# EAGLE design LePacific (EAGLE 7.7.0)
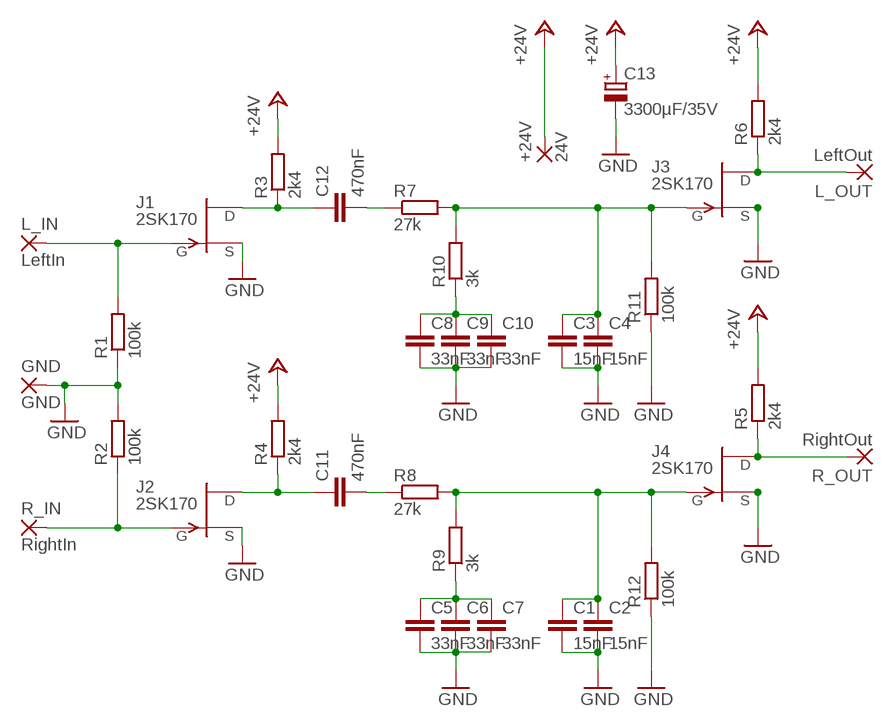
[diagram p0: schematic, sheet 1]

## Parts
+24V  24V  2,54/0,8  [2,54/0,8]
C1  15nF  C-EU150-054X183  [C150-054X183]
C2  15nF  C-EU150-054X183  [C150-054X183]
C3  15nF  C-EU150-054X183  [C150-054X183]
C4  15nF  C-EU150-054X183  [C150-054X183]
C5  33nF  C-EU225-062X268  [C225-062X268]
C6  33nF  C-EU225-062X268  [C225-062X268]
C7  33nF  C-EU225-062X268  [C225-062X268]
C8  33nF  C-EU225-062X268  [C225-062X268]
C9  33nF  C-EU225-062X268  [C225-062X268]
C10  33nF  C-EU225-062X268  [C225-062X268]
C11  470nF  C-EU225-108X268  [C225-108X268]
C12  470nF  C-EU225-108X268  [C225-108X268]
C13  3300µF/35V  CPOL-EUE7.5-16  [E7,5-16]
GND  GND  2,54/0,8  [2,54/0,8]
J1  2SK170  [TO-92]
J2  2SK170  [TO-92]
J3  2SK170  [TO-92]
J4  2SK170  [TO-92]
L_IN  LeftIn  2,54/0,8  [2,54/0,8]
L_OUT  LeftOut  2,54/0,8  [2,54/0,8]
R1  100k  R-EU_0207/10  [0207/10]
R2  100k  R-EU_0207/10  [0207/10]
R3  2k4  R-EU_0207/10  [0207/10]
R4  2k4  R-EU_0207/10  [0207/10]
R5  2k4  R-EU_0207/10  [0207/10]
R6  2k4  R-EU_0207/10  [0207/10]
R7  27k  R-EU_0207/10  [0207/10]
R8  27k  R-EU_0207/10  [0207/10]
R9  3k  R-EU_0207/10  [0207/10]
R10  3k  R-EU_0207/10  [0207/10]
R11  100k  R-EU_0207/10  [0207/10]
R12  100k  R-EU_0207/10  [0207/10]
R_IN  RightIn  2,54/0,8  [2,54/0,8]
R_OUT  RightOut  2,54/0,8  [2,54/0,8]

## Nets
+24V: +24V.1(P) C13.+ R3.2 R4.2 R5.2 R6.2
GND: C1.2 C2.2 C3.2 C4.2 C5.2 C6.2 C7.2 C8.2 C9.2 C10.2 C13.- GND.1(P) J1.3(S) J2.3(S) J3.3(S) J4.3(S) R1.1 R2.2 R11.1 R12.1
N$1: J1.2(G) L_IN.1(P) R1.2
N$2: J2.2(G) R2.1 R_IN.1(P)
N$3: C11.2 R8.1
N$4: C11.1 J2.1(D) R4.1
N$5: C12.1 J1.1(D) R3.1
N$6: C12.2 R7.1
N$7: C3.1 C4.1 J3.2(G) R7.2 R10.2 R11.2
N$8: C1.1 C2.1 J4.2(G) R8.2 R9.2 R12.2
N$9: J3.1(D) L_OUT.1(P) R6.1
N$10: J4.1(D) R5.1 R_OUT.1(P)
N$11: C5.1 C6.1 C7.1 R9.1
N$16: C8.1 C9.1 C10.1 R10.1

## Library data of the parts
+24V GND L_IN L_OUT R_IN R_OUT = wirepad:2,54/0,8: THROUGH-HOLE PAD
C1-C12 = rcl:C-EU: CAPACITOR, European symbol
C13 = rcl:CPOL-EU: POLARIZED CAPACITOR, European symbol
J1-J4 = toshiba-jfet:2SK170
R1-R12 = rcl:R-EU_: RESISTOR, European symbol

## Board
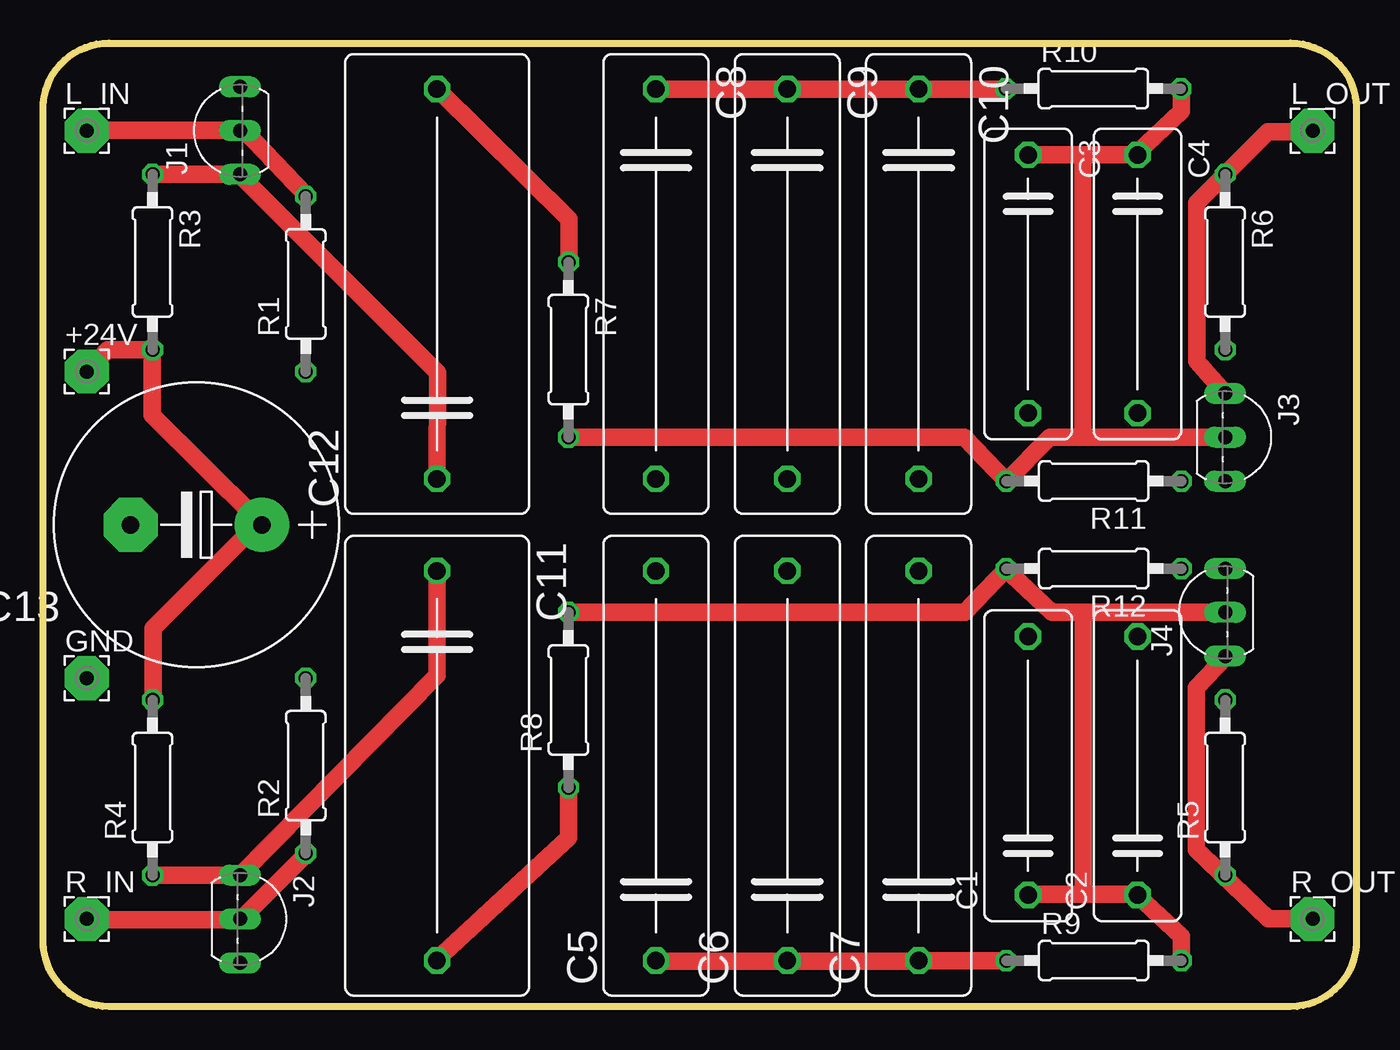
[diagram p1: board, top side]
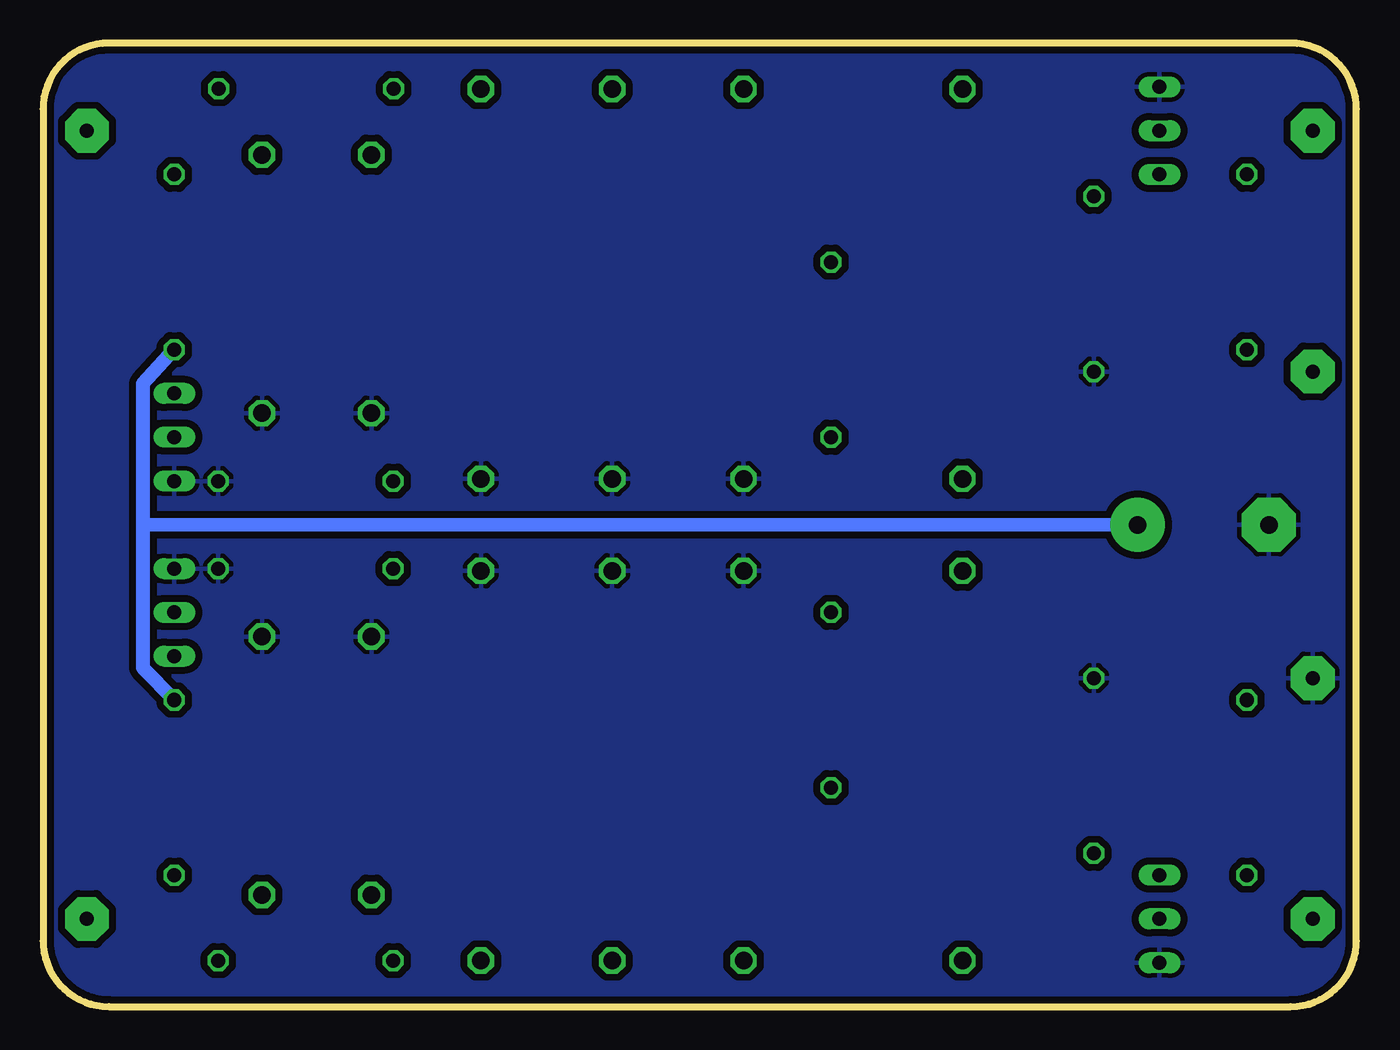
[diagram p2: board, bottom side, seen from below]

Size 76.2 x 55.88 mm. Coordinates in mm from the lower left corner, seen from the top.
Outline: 3.81,0 arc-90 0,3.81 0,52.07 arc-90 3.81,55.88 72.39,55.88 arc-90 76.2,52.07 76.2,3.81 arc-90 72.39,0 3.81,0
Copper layers (1*16): Top 0.0356mm / dielectric 1.5011mm / Bottom 0.0356mm
Design rules "LaenPCBOrder *": minimum track width 6mil, minimum drill 13mil, track to track 12mil, track to pad 6mil, pad to pad 6mil, via to via 6mil, smd to smd 6mil, copper to edge 15mil, drill to drill 6mil, minimum pad ring 7mil, minimum via ring 7mil, stop-mask expansion 3mil, vias tented up to drill 0mil, thermal gap 10mil

### Footprints (pad centres in the part's own frame; a part is rotated, then mirrored left to right if it is on the bottom)
2,54/0,8 = drill 0.813 pad 2.54 octagon: 1 0,0
C150-054X183 = drill 1.016 octagon: 1 -7.493,0; 2 7.493,0
C225-062X268 = drill 1.016 octagon: 1 -11.303,0; 2 11.303,0
C225-108X268 = drill 1.016 octagon: 1 -11.303,0; 2 11.303,0
E7,5-16 = drill 1.016 pad 3.15: + -3.81,0 | drill 1.016 pad 3.15 octagon: - 3.81,0
TO-92 = drill 0.813 long: 1 -2.54,0; 2 0,0; 3 2.54,0
0207/10 = drill 0.813 octagon: 1 -5.08,0; 2 5.08,0

### Placement (x,y rotation side)
+24V  2.54,36.83 0 top
C1  57.15,13.97 90 top
C2  63.5,13.97 90 top
C3  57.15,41.91 270 top
C4  63.5,41.91 270 top
C5  35.56,13.97 90 top
C6  43.18,13.97 90 top
C7  50.8,13.97 90 top
C8  35.56,41.91 270 top
C9  43.18,41.91 270 top
C10  50.8,41.91 270 top
C11  22.86,13.97 270 top
C12  22.86,41.91 90 top
C13  8.89,27.94 180 top
GND  2.54,19.05 0 top
J1  11.43,50.8 90 top
J2  11.43,5.08 270 top
J3  68.58,33.02 270 top
J4  68.58,22.86 90 top
L_IN  2.54,50.8 0 top
L_OUT  73.66,50.8 0 top
R1  15.24,41.91 90 top
R2  15.24,13.97 90 top
R3  6.35,43.18 270 top
R4  6.35,12.7 90 top
R5  68.58,12.7 90 top
R6  68.58,43.18 270 top
R7  30.48,38.1 270 top
R8  30.48,17.78 90 top
R9  60.96,2.67 0 top
R10  60.93,53.24 0 top
R11  60.96,30.48 180 top
R12  60.96,25.4 180 top
R_IN  2.54,5.08 0 top
R_OUT  73.66,5.08 0 top

### Tracks (layer width: path | path; a pad name or v marks a point on that pad's centre or on a via)
+24V
  Top 0.61: 6.04,38.1 R3.2 6.33,37.95 | 2.74,37.03 +24V.1 | 6.4,17.83 R4.2 | 12.34,27.89 C13.+ 12.34,28.35
  Top 1.016: 6.04,38.1 3.76,38.1 2.74,37.03 | 6.4,17.83 6.4,21.95 12.34,27.89 | 6.33,37.95 6.33,34.29 12.34,28.35
  Bottom 0.61: 68.58,17.8 R5.2 | 68.58,38.12 R6.2 | 13.08,27.94 C13.+
  Bottom 0.813: 68.58,17.8 70.41,19.66 70.41,27.91 | 70.41,27.91 70.41,36.12 68.58,38.12 | 13.08,27.94 70.41,27.91
GND
  pour Bottom (isolate 0.406): 3.81,0 arc-90 0,3.81 0,52.07 arc-90 3.81,55.88 72.39,55.88 arc-90 76.2,52.07 76.2,3.81 arc-90 72.39,0
N$1
  Top 0.61: 15.24,47.09 R1.2 | 2.82,50.83 L_IN.1 | 11.66,50.83 J1.2 11.66,50.83
  Top 1.016: 15.24,47.09 11.66,50.83 2.82,50.83
N$2
  Top 0.61: 11.58,5.16 J2.2 11.43,5.03 | 15.24,8.81 R2.1 | 2.74,5.03 R_IN.1
  Top 1.016: 15.24,8.81 11.58,5.16 | 2.74,5.03 11.43,5.03
N$3
  Top 0.61: 30.48,12.32 R8.1 | 22.86,2.74 C11.2
  Top 1.016: 30.48,12.32 30.48,9.78 22.86,2.74
N$4
  Top 0.61: 6.38,7.62 R4.1 | 22.86,25.15 C11.1
  Top 1.016: 6.38,7.62 J2.1 22.86,19.2 22.86,25.15
N$5
  Top 0.61: 6.45,48.29 R3.1 | 11.48,48.29 J1.1 11.46,48.18 | 22.86,30.63 C12.1
  Top 1.016: 11.48,48.29 6.45,48.29 | 22.86,30.63 22.88,36.75 11.46,48.18
N$6
  Top 0.61: 22.86,53.24 C12.2
  Top 1.016: 22.86,53.24 30.5,45.67 30.5,43.89 R7.1
N$7
  Top 0.61: 63.55,49.58 C4.1 | C3.1 60.33,49.4 | 60.33,33.15 60.45,33.02
  Top 1.016: 63.55,49.58 66.04,51.92 66.04,53.04 R10.2 | J3.2 60.45,33.02 58.42,33.02 R11.2 53.47,33.02 R7.2 | 60.33,49.4 C4.1 | C3.1 60.33,49.4 | 60.33,49.4 60.33,33.15
N$8
  Top 0.61: 63.55,6.4 C2.1 | 57.15,6.5 C1.1 | 30.63,22.86 R8.2 | 55.91,25.4 R12.2 56.24,25.02
  Top 1.016: 63.55,6.4 66.04,4.09 66.04,3.02 R9.2 | 60.35,6.5 63.3,6.5 C2.1 | 60.35,6.5 57.15,6.5 | 30.63,22.86 53.49,22.86 55.91,25.4 | 60.35,22.86 58.52,22.86 56.24,25.02 | 60.35,22.86 J4.2 | 60.35,22.86 60.35,6.5
N$9
  Top 0.61: 68.33,48.01 R6.1 68.78,48.46 | 73.61,50.75 L_OUT.1
  Top 1.016: J3.1 67.56,36.73 66.95,37.44 66.95,46.63 68.33,48.01 | 73.61,50.75 71.07,50.75 68.78,48.46
N$10
  Top 0.61: 68.66,7.47 R5.1 | 68.58,20.27 J4.1
  Top 1.016: 66.9,9.09 71.09,5.08 R_OUT.1 | 66.9,9.09 68.66,7.47 | 68.58,20.27 66.9,18.49 66.9,9.09
N$11
  Top 0.61: 55.68,2.67 R9.1 | 51.21,2.67 C7.1 | 35.66,2.64 C5.1 | 42.98,2.64 C6.1 43.41,2.64
  Top 1.016: 51.21,2.67 55.68,2.67 | 42.98,2.64 35.66,2.64 | 43.41,2.64 50.75,2.64 C7.1
N$16
  Top 0.61: 55.8,53.21 R10.1 | 35.71,53.21 C8.1 | 43.08,53.21 C9.1 43.38,53.21
  Top 1.016: 55.8,53.21 51.18,53.21 C10.1 43.38,53.21 | 43.08,53.21 35.71,53.21